# EAGLE design HIC_Board (EAGLE 7.5.0)
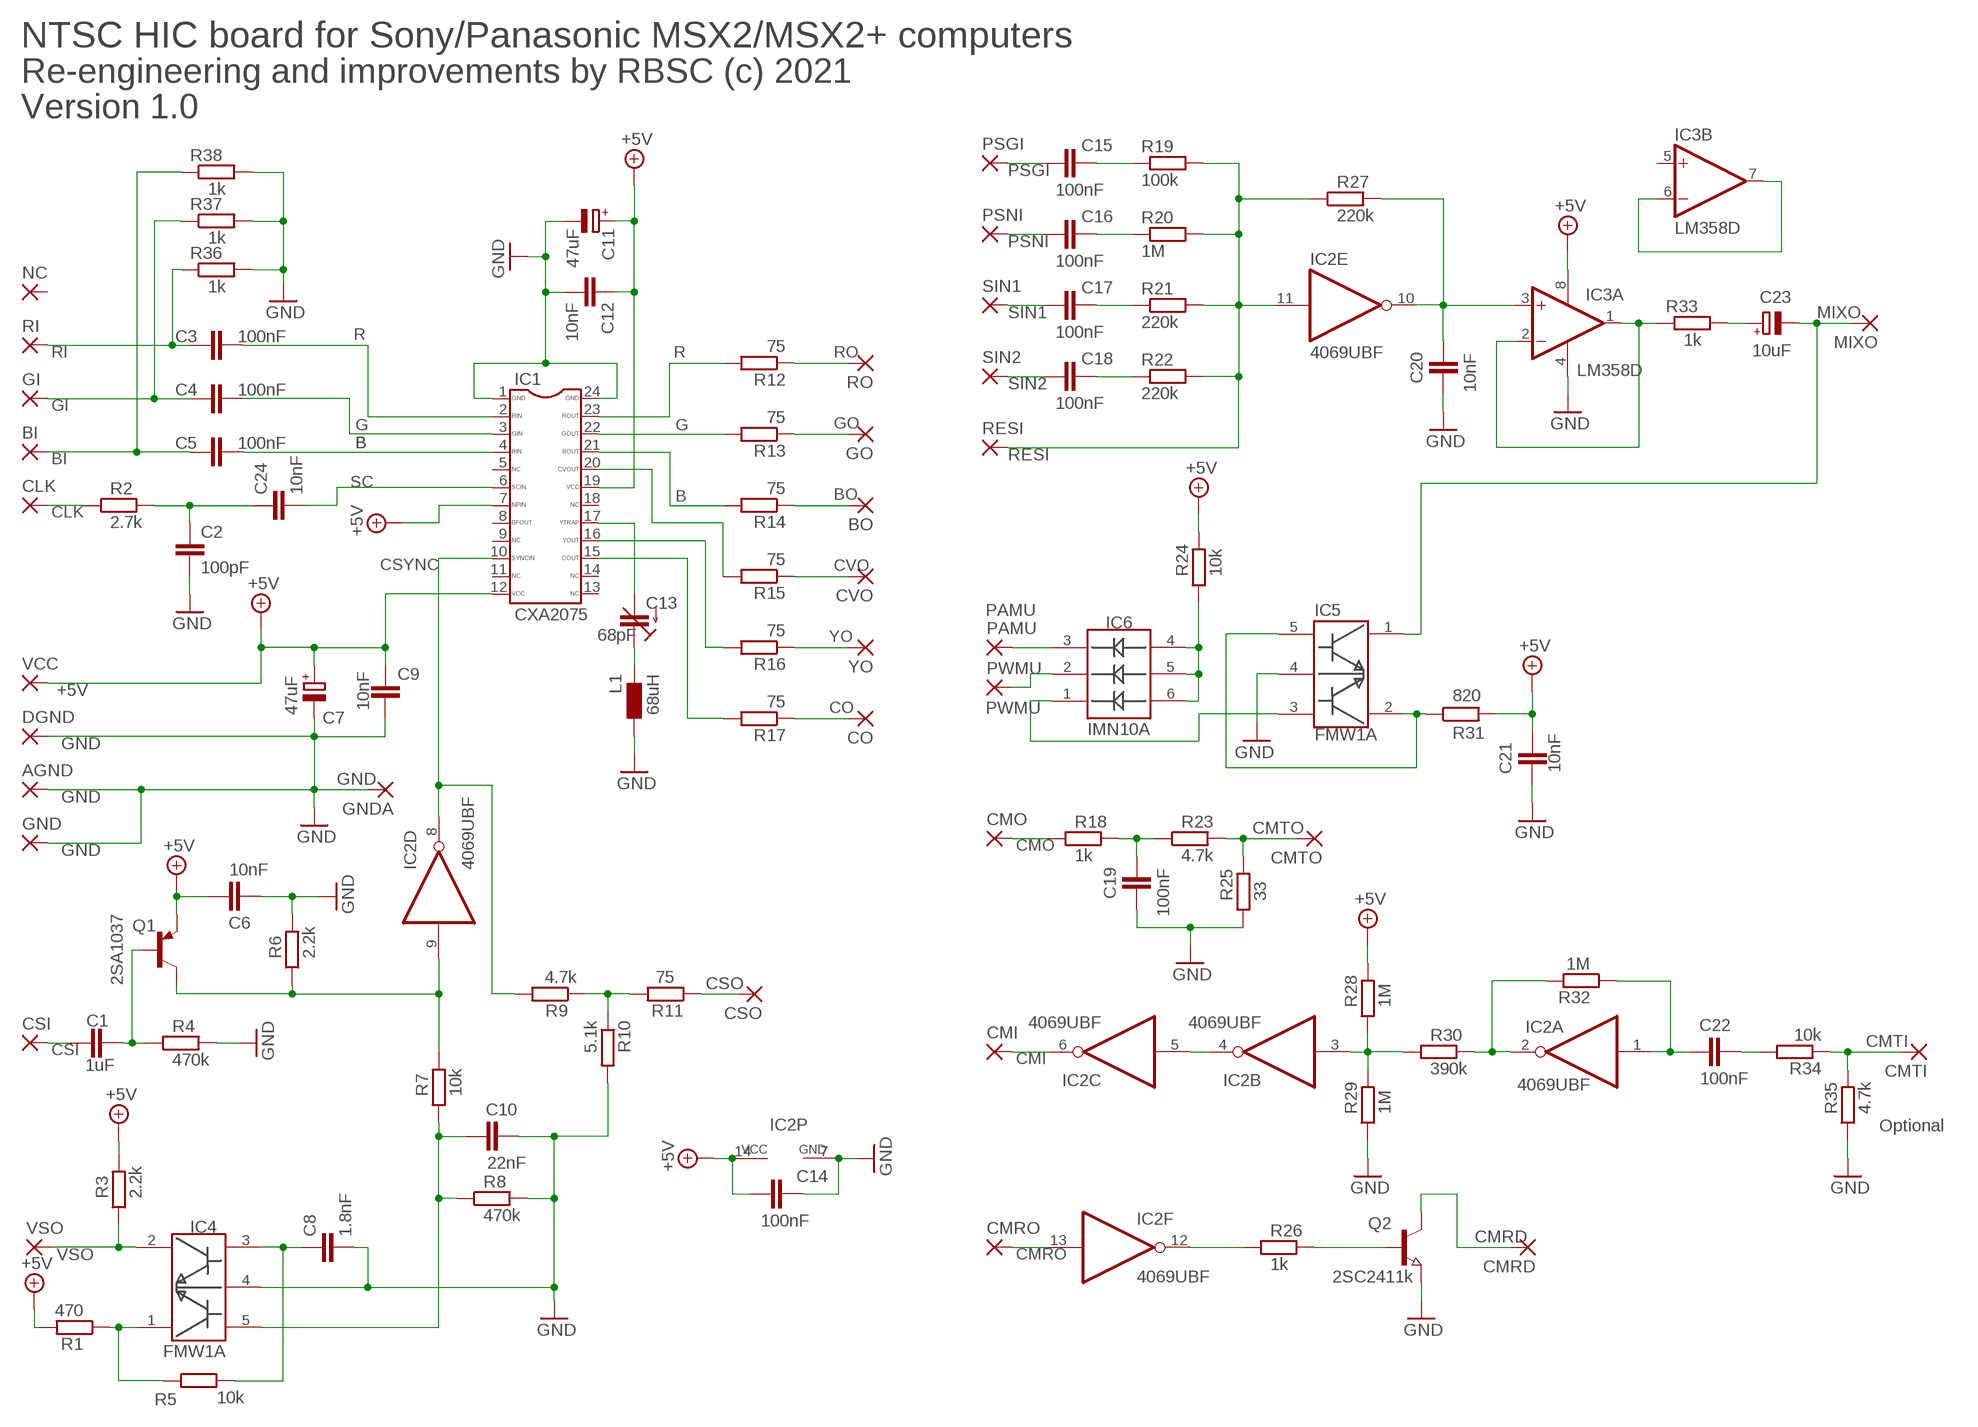
[diagram p0: schematic, sheet 1]

## Parts
AGND  HICPADSMD  [SMD1,27-2,54]
BI  HICPADSMD  [SMD1,27-2,54]
BO  HICPADSMD  [SMD1,27-2,54]
C1  1uF  C-EUC1210  [C1210]
C2  100pF  C-EUC0805  [C0805]
C3  100nF  C-EUC0805  [C0805]
C4  100nF  C-EUC0805  [C0805]
C5  100nF  C-EUC0805  [C0805]
C6  10nF  C-EUC0805  [C0805]
C7  47uF  CPOL-EUSMCB  [SMC_B]
C8  1.8nF  C-EUC0805  [C0805]
C9  10nF  C-EUC0805  [C0805]
C10  22nF  C-EUC0805  [C0805]
C11  47uF  CPOL-EUSMCB  [SMC_B]
C12  10nF  C-EUC0805  [C0805]
C13  68pF  C-TRIMMTZ03  [CTRIMTZ03]
C14  100nF  C-EUC0805  [C0805]
C15  100nF  C-EUC0805  [C0805]
C16  100nF  C-EUC0805  [C0805]
C17  100nF  C-EUC0805  [C0805]
C18  100nF  C-EUC0805  [C0805]
C19  100nF  C-EUC0805  [C0805]
C20  10nF  C-EUC0805  [C0805]
C21  10nF  C-EUC0805  [C0805]
C22  100nF  C-EUC0805  [C0805]
C23  10uF  CPOL-EUSMCB  [SMC_B]
C24  10nF  C-EUC0805  [C0805]
CLK  HICPADSMD  [SMD1,27-2,54]
CMI  HICPADSMD  [SMD1,27-2,54]
CMO  HICPADSMD  [SMD1,27-2,54]
CMRD  HICPADSMD  [SMD1,27-2,54]
CMRO  HICPADSMD  [SMD1,27-2,54]
CMTI  HICPADSMD  [SMD1,27-2,54]
CMTO  HICPADSMD  [SMD1,27-2,54]
CO  HICPADSMD  [SMD1,27-2,54]
CSI  HICPADSMD  [SMD1,27-2,54]
CSO  HICPADSMD  [SMD1,27-2,54]
CVO  HICPADSMD  [SMD1,27-2,54]
DGND  HICPADSMD  [SMD1,27-2,54]
GI  HICPADSMD  [SMD1,27-2,54]
GND  HICPADSMD  [SMD1,27-2,54]
GNDA  HICPADSMD  [SMD1,27-2,54]
GO  HICPADSMD  [SMD1,27-2,54]
IC1  CXA2075  [SOP24]
IC2  4069UBF  74HCT04D  [SO14]
IC3  LM358D  [SO08]
IC4  FMW1A  [SMT5]
IC5  FMW1A  [SMT5]
IC6  IMN10A  [SMT6]
L1  68uH  LL3225M  [L3225M]
MIXO  HICPADSMD  [SMD1,27-2,54]
NC  HICPADSMD  [SMD1,27-2,54]
PAMU  HICPADSMD  [SMD1,27-2,54]
PSGI  HICPADSMD  [SMD1,27-2,54]
PSNI  HICPADSMD  [SMD1,27-2,54]
PWMU  HICPADSMD  [SMD1,27-2,54]
Q1  2SA1037  BCX71SMD  [SOT23]
Q2  2SC2411k  NPN-TRANSISTOR_SOT23  [SOT23]
R1  470  R-EU_R0805  [R0805]
R2  2.7k  R-EU_R0805  [R0805]
R3  2.2k  R-EU_R0805  [R0805]
R4  470k  R-EU_R0805  [R0805]
R5  10k  R-EU_R0805  [R0805]
R6  2.2k  R-EU_R0805  [R0805]
R7  10k  R-EU_R0805  [R0805]
R8  470k  R-EU_R0805  [R0805]
R9  4.7k  R-EU_R0805  [R0805]
R10  5.1k  R-EU_R0805  [R0805]
R11  75  R-EU_R0805  [R0805]
R12  75  R-EU_R0805  [R0805]
R13  75  R-EU_R0805  [R0805]
R14  75  R-EU_R0805  [R0805]
R15  75  R-EU_R0805  [R0805]
R16  75  R-EU_R0805  [R0805]
R17  75  R-EU_R0805  [R0805]
R18  1k  R-EU_R0805  [R0805]
R19  100k  R-EU_R0805  [R0805]
R20  1M  R-EU_R0805  [R0805]
R21  220k  R-EU_R0805  [R0805]
R22  220k  R-EU_R0805  [R0805]
R23  4.7k  R-EU_R0805  [R0805]
R24  10k  R-EU_R0805  [R0805]
R25  33  R-EU_R0805  [R0805]
R26  1k  R-EU_R0805  [R0805]
R27  220k  R-EU_R0805  [R0805]
R28  1M  R-EU_R0805  [R0805]
R29  1M  R-EU_R0805  [R0805]
R30  390k  R-EU_R0805  [R0805]
R31  820  R-EU_R0805  [R0805]
R32  1M  R-EU_R0805  [R0805]
R33  1k  R-EU_R0805  [R0805]
R34  10k  R-EU_R0805  [R0805]
R35  4.7k  R-EU_R0805  [R0805]
R36  1k  R-EU_R0805  [R0805]
R37  1k  R-EU_R0805  [R0805]
R38  1k  R-EU_R0805  [R0805]
RESI  HICPADSMD  [SMD1,27-2,54]
RI  HICPADSMD  [SMD1,27-2,54]
RO  HICPADSMD  [SMD1,27-2,54]
SIN1  HICPADSMD  [SMD1,27-2,54]
SIN2  HICPADSMD  [SMD1,27-2,54]
VCC  HICPADSMD  [SMD1,27-2,54]
VSO  HICPADSMD  [SMD1,27-2,54]
YO  HICPADSMD  [SMD1,27-2,54]

## Nets
+5V: C6.1 C7.+ C9.2 C11.+ C12.1 C14.2 C21.2 IC1.7 IC1.12 IC1.19 IC2.14(P:VCC) IC3.8(P:V+) Q1.2(E) R1.2 R3.2 R24.2 R28.2 R31.2 VCC.1(P)
CMRD: CMRD.1(P) Q2.3(C)
CMTI: CMTI.1(P) R34.1 R35.2
CMTO: CMTO.1(P) R23.2 R25.2
CSO: CSO.1(P) R11.1
GND: AGND.1(P) C2.1 C6.2 C7.- C8.1 C9.1 C10.2 C11.- C12.2 C14.1 C19.2 C20.2 C21.1 DGND.1(P) GND.1(P) GNDA.1(P) IC1.1 IC1.24 IC2.7(P:GND) IC3.4(P:V-) IC4.4 IC5.4 L1.1 Q2.2(E) R4.2 R6.2 R8.2 R10.2 R25.1 R29.1 R35.1 R36.2 R37.2 R38.2
MIXO: C23.- IC5.1 MIXO.1(P)
N$1: IC1.23 R12.2
N$2: IC1.22 R13.2
N$3: IC1.21 R14.2
N$4: R12.1 RO.1(P)
N$5: GO.1(P) R13.1
N$6: C3.1 R36.1 RI.1(P)
N$7: C4.1 GI.1(P) R37.1
N$8: BO.1(P) R14.1
N$9: R16.1 YO.1(P)
N$10: CVO.1(P) R15.1
N$11: C2.2 C24.2 R2.2
N$13: C1.2 CSI.1(P)
N$14: CLK.1(P) R2.1
N$15: C13.1(E) L1.2
N$16: IC1.16 R16.2
N$17: CMO.1(P) R18.1
N$19: CMI.1(P) IC2.6(C:O)
N$21: C19.1 R18.2 R23.1
N$22: IC2.4(B:O) IC2.5(C:I)
N$24: C13.2(A) IC1.17
N$25: IC2.3(B:I) R28.1 R29.2 R30.1
N$26: CMRO.1(P) IC2.13(F:I)
N$27: IC2.2(A:O) R30.2 R32.2
N$28: C22.1 IC2.1(A:I) R32.1
N$29: C22.2 R34.2
N$31: IC2.12(F:O) R26.1
N$32: Q2.1(B) R26.2
N$38: C17.2 R21.1
N$39: C15.2 R19.1
N$40: C16.2 R20.1
N$41: C18.2 R22.1
N$43: C20.1 IC2.10(E:O) IC3.3(A:+IN) R27.2
N$44: C23.+ R33.2
N$46: IC3.6(B:-IN) IC3.7(B:OUT)
N$47: IC5.2 IC5.5 R31.1
N$48: IC5.3 IC6.1
N$49: IC6.4 IC6.5 IC6.6 R24.1
N$51: C1.1 Q1.1(B) R4.1
N$52: IC3.1(A:OUT) IC3.2(A:-IN) R33.1
N$53: IC2.9(D:I) Q1.3(C) R6.1 R7.2
N$54: C8.2 IC4.3 R5.2
N$55: BI.1(P) C5.1 R38.1
N$56: C4.2 IC1.3
N$57: C3.2 IC1.2
N$58: C5.2 IC1.4
N$59: IC1.10 IC2.8(D:O) R9.2
N$60: IC4.1 R1.1 R5.1
N$61: R9.1 R10.1 R11.2
N$62: C10.1 IC4.5 R7.1 R8.1
N$63: C24.1 IC1.6
N$64: IC1.20 R15.2
N$65: CO.1(P) R17.1
N$68: IC1.15 R17.2
PAMU: IC6.3 PAMU.1(P)
PSGI: C15.1 PSGI.1(P)
PSNI: C16.1 PSNI.1(P)
PWMU: IC6.2 PWMU.1(P)
RESI: IC2.11(E:I) R19.2 R20.2 R21.2 R22.2 R27.1 RESI.1(P)
SIN1: C17.1 SIN1.1(P)
SIN2: C18.1 SIN2.1(P)
VSO: IC4.2 R3.1 VSO.1(P)
Unconnected: IC1.5 IC1.8 IC1.9 IC1.11 IC1.13 IC1.14 IC1.18 IC3.5(B:+IN) NC.1(P)

## Notes on the sheet
- NTSC HIC board for Sony/Panasonic MSX2/MSX2+ computers
- Re-engineering and improvements by RBSC (c) 2021
- Version 1.0
- R
- RI | R | RO
- GI
- G | G | GO
- B | B
- BI
- SC
- B | BO
- CLK
- CSYNC
- CVO
- YO
- CO
- CMO
- CSI
- CMI
- Optional
- CMRO

## Library data of the parts
AGND BI BO CLK CMI CMO CMRD CMRO CMTI CMTO CO CSI CSO CVO DGND GI GND GNDA GO MIXO NC PAMU PSGI PSNI PWMU RESI RI RO SIN1 SIN2 VCC VSO YO = combopad:HICPADSMD: SMD PAD
C1-C6 C8-C10 C12 C14-C22 C24 = rcl:C-EU: CAPACITOR, European symbol; OC_FARNELL: unknown
C7 C11 C23 = rcl:CPOL-EU: POLARIZED CAPACITOR, European symbol; OC_FARNELL: unknown
C13 = rcl:C-TRIMM: Trimm capacitor
IC1 = CXA2075M:CXA2075; OC_FARNELL: unknown
IC2 = 74xx-eu:74*04: Hex INVERTER
IC3 = linear:LM358: OP AMP also LM158; LM258; LM2904 Source: http://cache.national.com/ds/LM/LM158.pdf
IC4 IC5 = fmw1:FMW1: FMW1
IC6 = imn10:IMN10: IMN10
L1 = eagle-ltspice:L: INDUCTOR, European symbol; SPICEMODEL: NONE; SPICEPREFIX: L
Q1 = transistor-pnp:BCX71SMD: PNP Transistor
Q2 = semicon-smd-ipc:NPN-TRANSISTOR_: NPN TRANSISTOR
R1-R38 = rcl:R-EU_: RESISTOR, European symbol; OC_FARNELL: unknown

## Board
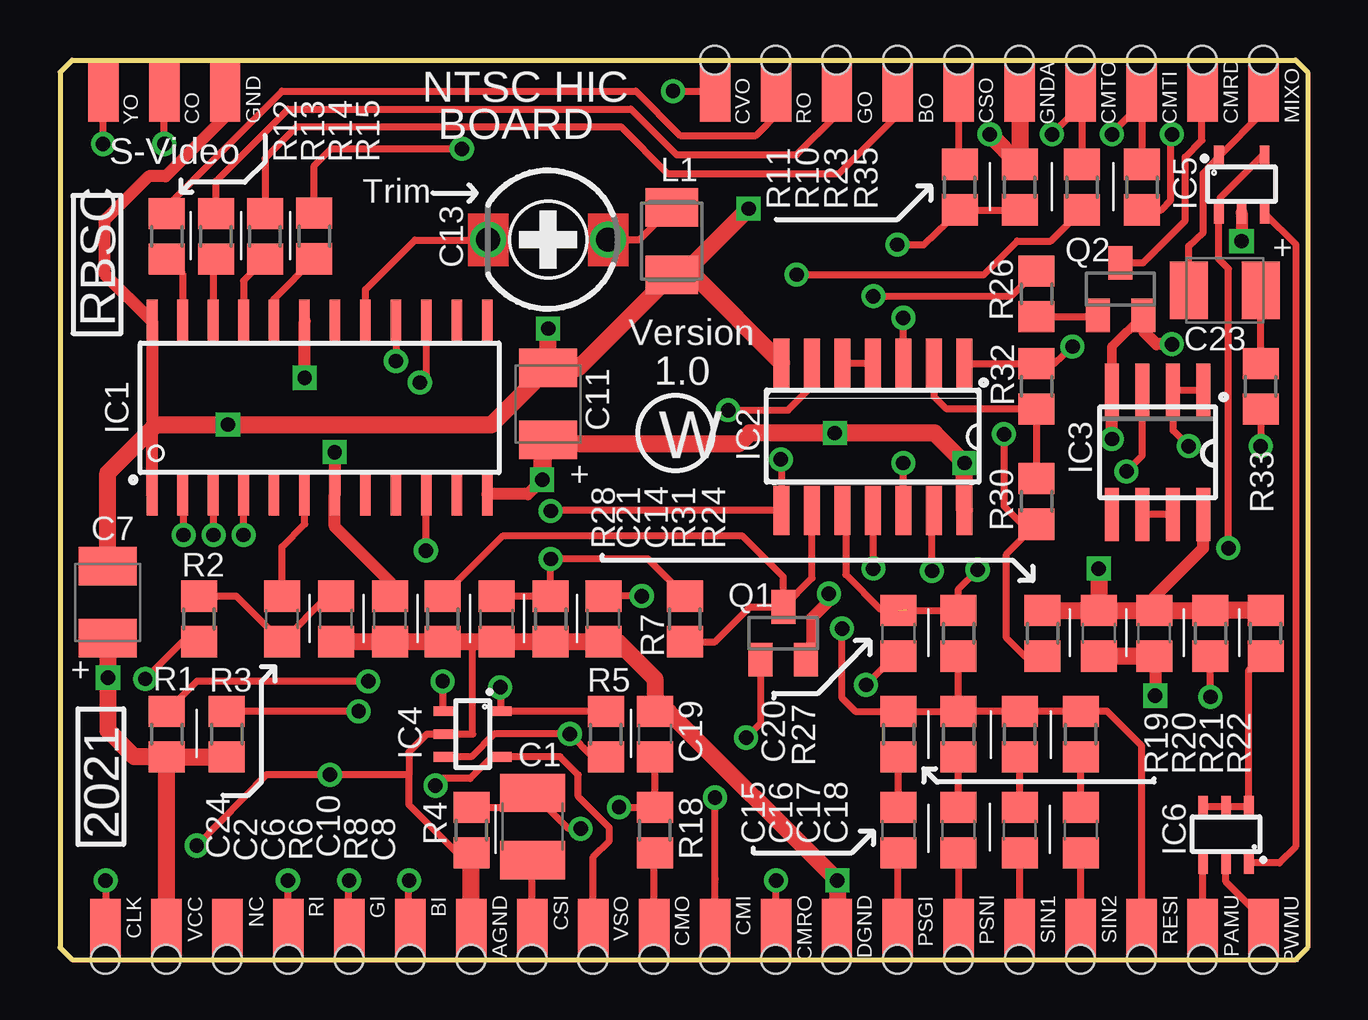
[diagram p1: board, top side]
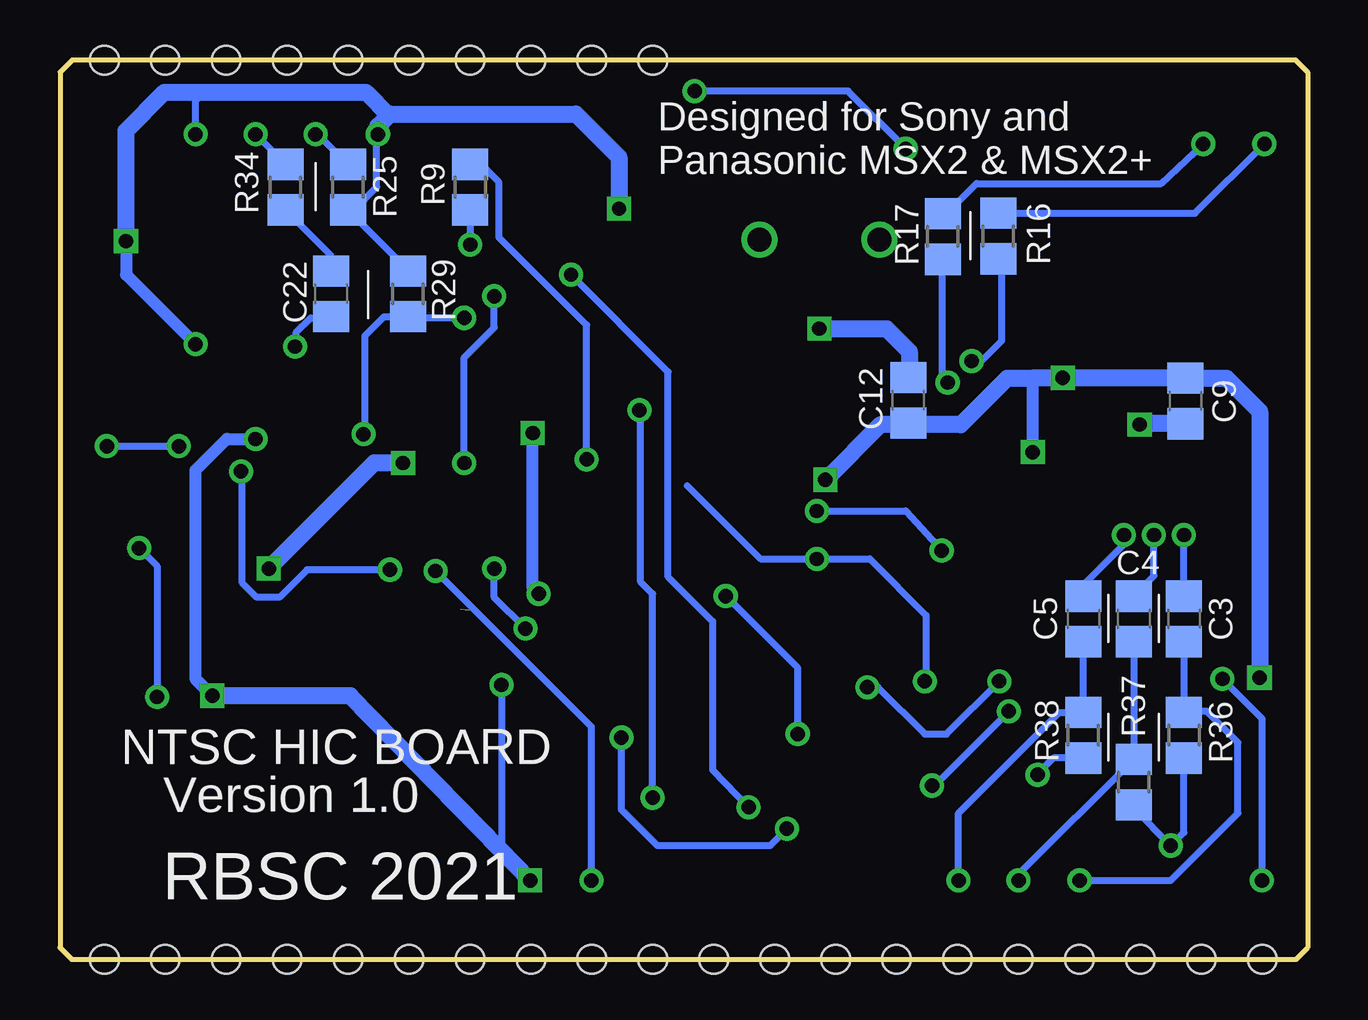
[diagram p2: board, bottom side, seen from below]

Size 52 x 37.5 mm. Coordinates in mm from the lower left corner, seen from the top.
Outline: 0,37 0,0.5 0.5,0 51.5,0 52,0.5 52,37 51.5,37.5 0.5,37.5 0,37
Copper layers (1*16): Top 0.035mm / dielectric 1.5mm / Bottom 0.035mm
Design rules "default *": minimum track width 10mil, minimum drill 24mil, track to track 8mil, track to pad 8mil, pad to pad 8mil, via to via 8mil, smd to smd 8mil, copper to edge 4mil, drill to drill 8mil, minimum pad ring 10mil, minimum via ring 8mil, stop-mask expansion 4mil, vias tented up to drill 24mil, thermal gap 10mil
Holes 1.2 mm at 27.29,37.49 29.83,37.49 32.37,37.49 34.91,37.49 37.45,37.49 39.99,37.49 42.53,37.49 45.07,37.49 47.61,37.49 50.15,37.49 1.89,0.01 4.43,0.01 6.97,0.01 9.51,0.01 12.05,0.01 14.59,0.01 17.13,0.01 19.67,0.01 22.21,0.01 24.75,0.01 27.29,0.01 29.83,0.01 32.37,0.01 34.91,0.01 37.45,0.01 39.99,0.01 42.53,0.01 45.07,0.01 47.61,0.01 50.15,0.01

### Footprints (pad centres in the part's own frame; a part is rotated, then mirrored left to right if it is on the bottom)
SMD1,27-2,54 = smd 1.27 x 2.54: 1 0,0
C1210 = smd 1.6 x 2.7: 1 -1.4,0; 2 1.4,0
C0805 = smd 1.3 x 1.5: 1 -0.95,0; 2 0.95,0
SMC_B = smd 1.6 x 2.4: + -1.5,0; - 1.5,0
CTRIMTZ03 = drill 1: 1 0,2.5; 2 0,-2.5
SOP24 = smd 0.45 x 1.8: 1 -6.97,-3.6; 2 -5.7,-3.6; 3 -4.43,-3.6; 4 -3.16,-3.6; 5 -1.89,-3.6; 6 -0.62,-3.6; 7 0.65,-3.6; 8 1.92,-3.6; 9 3.19,-3.6; 10 4.46,-3.6; 11 5.73,-3.6; 12 7,-3.6; 13 7,3.6; 14 5.73,3.6; 15 4.46,3.6; 16 3.19,3.6; 17 1.92,3.6; 18 0.65,3.6; 19 -0.62,3.6; 20 -1.89,3.6; 21 -3.16,3.6; 22 -4.43,3.6; 23 -5.7,3.6; 24 -6.97,3.6
SO14 = smd 0.66 x 2.032: 1 -3.81,-3.073; 2 -2.54,-3.073; 3 -1.27,-3.073; 4 0,-3.073; 5 1.27,-3.073; 6 2.54,-3.073; 7 3.81,-3.073; 8 3.81,3.073; 9 2.54,3.073; 10 1.27,3.073; 11 0,3.073; 12 -1.27,3.073; 13 -2.54,3.073; 14 -3.81,3.073
SO08 = smd 0.6 x 2.2: 1 -1.905,-2.6; 2 -0.635,-2.6; 3 0.635,-2.6; 4 1.905,-2.6; 5 1.905,2.6; 6 0.635,2.6; 7 -0.635,2.6; 8 -1.905,2.6
SMT5 = smd 0.9 x 0.4: 1 1.175,0.95; 2 1.175,-0.95; 3 -1.175,-0.95; 4 -1.175,0; 5 -1.175,0.95
SMT6 = smd 0.9 x 0.4: 1 1.175,0.95; 2 1.175,0; 3 1.175,-0.95; 4 -1.175,-0.95; 5 -1.175,0; 6 -1.175,0.95
L3225M = smd 1.6 x 2.2: 1 -1.4,0; 2 1.4,0
SOT23 = smd 1 x 1.4: 1 -0.95,-1.1; 2 0.95,-1.1; 3 0,1.1
R0805 = smd 1.3 x 1.5: 1 -0.95,0; 2 0.95,0

### Placement (x,y rotation side)
AGND  17.14,1.27 0 top
BI  14.61,1.27 0 top
BO  34.92,36.2 180 top
C1  19.7,5.55 270 top
C2  11.5,14.2 90 top
C3  5.15,14.2 90 bottom
C4  7.24,14.2 90 bottom
C5  9.34,14.2 90 bottom
C6  13.75,14.2 270 top
C7  1.99,14.89 90 top
C8  22.65,14.2 90 top
C9  5.09,23.29 90 bottom
C10  18.2,14.2 270 top
C11  20.34,23.16 90 top
C12  16.64,23.31 90 bottom
C13  20.34,30.01 270 top
C14  45.61,13.6 90 top
C15  34.95,5.4 90 top
C16  37.45,5.4 90 top
C17  40,5.4 90 top
C18  42.55,5.4 90 top
C19  24.8,9.4 90 top
C20  34.95,13.6 270 top
C21  43.3,13.6 90 top
C22  40.7,27.75 90 bottom
C23  48.55,27.9 180 top
C24  9.25,14.2 270 top
CLK  1.91,1.27 0 top
CMI  27.3,1.27 0 top
CMO  24.77,1.27 0 top
CMRD  47.62,36.2 180 top
CMRO  29.84,1.27 0 top
CMTI  45.09,36.2 180 top
CMTO  42.55,36.2 180 top
CO  4.34,36.2 180 top
CSI  19.68,1.27 0 top
CSO  37.47,36.2 180 top
CVO  27.3,36.2 180 top
DGND  32.38,1.27 0 top
GI  12.06,1.27 0 top
GND  6.88,36.2 0 top
GNDA  40.01,36.2 180 top
GO  32.38,36.2 180 top
IC1  10.81,23 0 top
IC2  33.89,21.8 180 top
IC3  45.75,21.15 180 top
IC4  17.2,9.4 0 top
IC5  49.25,32.3 90 top
IC6  48.6,5.2 270 top
L1  25.5,29.95 90 top
MIXO  50.16,36.2 180 top
NC  6.99,1.27 0 top
PAMU  47.62,1.27 0 top
PSGI  34.92,1.27 0 top
PSNI  37.47,1.27 0 top
PWMU  50.16,1.27 0 top
Q1  30.15,13.6 0 top
Q2  44.2,27.95 0 top
R1  4.45,9.4 270 top
R2  5.8,14.2 90 top
R3  6.95,9.4 270 top
R4  17.15,5.4 270 top
R5  22.75,9.4 270 top
R6  15.95,14.2 270 top
R7  26.05,14.2 270 top
R8  20.45,14.2 270 top
R9  34.9,32.2 90 bottom
R10  40,32.2 90 top
R11  37.5,32.2 270 top
R12  4.45,30.15 270 top
R13  6.5,30.15 270 top
R14  8.55,30.15 270 top
R15  10.6,30.16 270 top
R16  12.89,30.16 270 bottom
R17  15.21,30.14 270 bottom
R18  24.8,5.4 90 top
R19  34.95,9.4 90 top
R20  37.45,9.4 90 top
R21  40,9.4 90 top
R22  42.55,9.4 90 top
R23  42.6,32.2 90 top
R24  50.25,13.6 90 top
R25  40,32.2 90 bottom
R26  40.7,27.75 270 top
R27  37.45,13.6 90 top
R28  40.95,13.6 90 top
R29  37.5,27.75 270 bottom
R30  40.7,19.1 90 top
R31  47.95,13.6 90 top
R32  40.7,23.9 270 top
R33  50.05,23.9 90 top
R34  42.6,32.2 270 bottom
R35  45.1,32.2 90 top
R36  5.15,9.35 270 bottom
R37  7.25,7.4 270 bottom
R38  9.35,9.35 270 bottom
RESI  45.09,1.27 0 top
RI  9.53,1.27 0 top
RO  29.84,36.2 180 top
SIN1  40.01,1.27 0 top
SIN2  42.55,1.27 0 top
VCC  4.45,1.27 0 top
VSO  22.23,1.27 0 top
YO  1.8,36.2 180 top

### Tracks (layer width: path | path; a pad name or v marks a point on that pad's centre or on a via)
+5V  (via drill 0.6)
  Top 0.3: C14.2 45.61,15.11 | IC3.8 | C11.+ 20.34,20.25 v20.1,20 | IC1.12 | C6.1 13.75,15.75 | IC1.7
  Top 0.4: 10.2,26.59 IC1.19 | v11.46,21.14 v11.45,21.15
  Top 0.5: 45.61,15.11 47.65,17.15 IC3.8 | v20.1,20 19.5,19.4 IC1.12 | v10.2,24.25 10.2,26.59 | IC1.7 v11.46,21.14 | 13.75,15.75 11.45,18.05 IC1.7 | v32.05,15.25 32.05,14.95 31.35,14.25 31.35,12.75 Q1.2
  Top 0.7: v20.1,20 20.1,21.41 C11.+ 20.5,21.5 28.3,21.5 28.75,21.95 v32.3,21.95 36.45,21.95 v37.7,20.7 IC2.14 | VCC.1 R1.2 | R1.2 R3.2 | R1.2 3.1,8.45 2,9.55 v2,11.75 C7.+ | v43.3,16.3 C21.2 | C21.2 C14.2 R31.2 R24.2 | R28.2 C21.2
  Bottom 0.4: 10.21,24.23 v10.2,24.25
  Bottom 0.5: v11.45,21.15 11.45,24.18 | v32.05,15.25 32.3,15.5 v32.3,21.95
  Bottom 0.7: 11.5,24.23 10.21,24.23 C9.2 3.38,24.23 2,22.85 v2,11.75 | 16.59,22.3 14.45,22.3 12.52,24.23 11.5,24.23 | 16.59,22.3 C12.1 | 16.59,22.3 17.8,22.3 v20.1,20 | v37.7,20.7 38.9,20.7 v43.3,16.3 | 11.5,24.23 11.45,24.18
CMRD
  Top 0.3: Q2.3 45.15,29.05 46.9,30.8 46.9,33.45 47.6,34.15 47.6,36.17 CMRD.1
CMTI  (via drill 0.6)
  Top 0.3: CMTI.1 45.1,36.18 45.1,35.7 | 45.1,35.7 R35.2 | v43.85,34.4 43.85,34.45 45.1,35.7
  Bottom 0.3: R34.1 v43.85,34.4
CMTO  (via drill 0.6)
  Top 0.3: CMTO.1 42.6,36.14 42.6,35.65 | 42.6,35.65 R23.2 | v41.35,34.4 42.6,35.65
  Bottom 0.3: v41.35,34.4 41.2,34.35 R25.2
CSO
  Top 0.3: 37.5,36.16 CSO.1 37.47,33.19 R11.1
GND  (via drill 0.6)
  Top 0.3: R4.2 16.55,4.45 14.55,6.45 14.55,7.7 | 32.4,1.28 DGND.1 | 24.4,10 C19.2 | C11.- 20.79,24.66 | v20.34,26.3 v20.35,26.3 | 45.2,26.15 45.2,26.8 Q2.2 | 17.25,13.25 17.2,13.2 17.2,9.4 IC4.4 15.3,9.4 14.55,8.65 14.55,7.7 | C14.1 45.65,12.61 | v43.85,21.7 v43.84,21.7 | R10.2 39.95,33.16 | R35.1 45.9,31.25 46.3,31.65 46.3,34.3 v46.35,34.4 | 14.55,7.7 v11.25,7.7 8.6,7.7 v5.7,4.75 | C20.2 34.8,12.65 v33.6,11.45
  Top 0.4: IC3.4 43.84,25.55 Q2.2 | 3.84,22.26 3.9,22.2 | 3.84,22.11 3.83,22.12
  Top 0.5: IC5.4 v49.25,29.95 | v46.35,25.65 45.7,25.65 45.2,26.15 | 3.84,22.26 IC1.24 1.85,28.59 1.85,30.8 3.7,32.65 4.4,32.65 6.88,35.13 GND.1 | IC1.1 3.84,22.11 | 45.65,12.61 v45.65,11 | v43.84,21.7 IC3.4
  Top 0.7: AGND.1 R4.2 | 32.4,1.28 v32.4,3.3 25.35,10.35 C19.2 24.8,11.7 23.3,13.2 22.7,13.2 C8.1 R8.2 C10.2 17.25,13.25 R6.2 C6.2 C2.1 | v20.34,26.3 C11.- 17.98,22.3 v7,22.3 4,22.3 3.9,22.2 3.83,22.12 1.99,20.29 C7.- | 20.79,24.66 21.61,24.66 L1.1 | L1.1 26.4,28.55 IC2.7 | C21.1 C14.1 | L1.1 25.95,28.55 v28.7,31.3 | GNDA.1 R10.2 | 39.95,33.16 v38.75,34.4
  Bottom 0.3: 16.6,24.3 C12.2 | R29.1 37.5,29.15 37.9,29.15 R25.1 39.75,31.25 38.8,32.2 38.8,34.35 v38.75,34.4 | v46.35,34.4 46.35,35.8 46,36.15 | 6.96,22.34 v7,22.3 | R38.2 10.6,8.4 11.25,7.75 v11.25,7.7 | R37.2 7.25,6.3 v5.7,4.75 5.15,5.3 R36.2 | v33.6,11.45 33.6,4.64 33.65,4.59
  Bottom 0.5: v49.25,29.95 49.25,28.55 v46.35,25.65 | v45.65,11 46.35,11.7 46.35,20.4 45.05,21.7 v43.85,21.7
  Bottom 0.7: v20.35,26.3 17.55,26.3 16.6,25.35 16.6,24.3 | v32.4,3.3 33.65,4.59 39.9,11 v45.65,11 | 38.3,35.2 38.25,35.25 30.5,35.25 28.7,33.45 v28.7,31.3 28.75,31.3 | v49.25,29.95 49.25,34.55 47.65,36.15 46,36.15 39.25,36.15 38.3,35.2 | v38.75,34.4 38.75,34.75 38.3,35.2 | C9.1 6.96,22.34
MIXO
  Top 0.3: MIXO.1 50.16,35.34 IC5.1 47.65,32.77 47.65,30.3 47.05,29.75 C23.-
N$1
  Top 0.3: R12.2 5.11,28.59 IC1.23
N$2
  Top 0.3: R13.2 6.38,29.08 IC1.22
N$3
  Top 0.3: R14.2 7.65,28.3 IC1.21
N$4
  Top 0.3: R12.1 4.5,31.45 9.25,36.2 24,36.2 25.85,34.35 29,34.35 30.05,35.4 30.05,35.99 RO.1
N$5
  Top 0.3: R13.1 6.5,32.45 9.5,35.45 23.8,35.45 25.7,33.55 30.7,33.55 32.4,35.25 32.4,36.18 GO.1
N$6  (via drill 0.6)
  Top 0.3: RI.1 9.5,1.29 v9.5,3.3
  Bottom 0.3: C3.1 R36.1 5.1,10.35 4.2,10.35 2.9,9.05 2.9,6.1 5.7,3.3 v9.5,3.3
N$7  (via drill 0.6)
  Top 0.3: GI.1 12.04,1.29 v12.04,3.29 v12.05,3.3
  Bottom 0.3: C4.1 R37.1 12.05,3.55 v12.05,3.3
N$8
  Top 0.3: 34.92,36.12 BO.1 34.95,36.17 34.95,35.25 32.45,32.75 25.35,32.75 23.4,34.7 9.85,34.7 8.55,33.4 R14.1
N$9  (via drill 0.6)
  Top 0.3: v1.8,34 YO.1
  Bottom 0.3: R16.1 4.69,31.11 v1.8,34
N$10  (via drill 0.6)
  Top 0.3: R15.1 10.6,33.09 11.3,33.8 v16.75,33.8 | v25.55,36.2 CVO.1
  Bottom 0.3: v16.75,33.8 19.15,36.2 v25.55,36.2
N$11
  Top 0.3: R2.2 7.35,15.15 C24.2 11.15,15.15 C2.2
N$13
  Top 0.3: CSI.1 19.68,4.13 C1.2
N$14  (via drill 0.6)
  Top 0.3: 2,1.36 CLK.1 1.91,3.65 v1.9,3.3 | R2.1 5.1,13.25 v3.55,11.7
  Bottom 0.3: v3.55,11.7 1.9,10.05 v1.9,3.3
N$15
  Top 0.3: C13.1 24.16,30.01 L1.2
N$16  (via drill 0.6)
  Top 0.3: IC1.16 v14,24.95
  Bottom 0.3: v14,24.95 13.6,24.95 12.75,25.8 12.75,29.07 R16.2
N$17
  Top 0.3: CMO.1 24.77,4.42 R18.1
N$19  (via drill 0.6)
  Top 0.3: v27.85,22.9 30.35,22.9 31.35,23.9 IC2.6 | CMI.1 27.3,3.35 v27.3,6.75
  Bottom 0.3: v27.85,22.9 27.8,22.85 27.8,15.75 27.3,15.25 v27.3,6.75
N$21  (via drill 0.6)
  Top 0.3: v30.7,28.55 38.5,28.55 39.9,29.95 41.3,29.95 R23.1 | C19.1 R18.2 v23.3,6.35
  Bottom 0.3: v30.7,28.55 26.65,24.5 26.65,15.95 24.8,14.1 24.8,7.9 v23.3,6.35
N$22
  Top 0.3: IC2.5 IC2.4
N$24
  Top 0.3: IC1.17 12.73,27.93 14.8,30 C13.2
N$25  (via drill 0.6)
  Top 0.3: IC2.3 v35.16,26.76 v35.15,26.75 | R28.1 40.2,12.65 39.45,13.4 39.45,16.9 R30.1 40.1,18.15 39.35,18.9 v39.35,21.9
  Bottom 0.3: v39.35,21.9 39.3,21.95 39.3,26 38.5,26.8 R29.2 37.45,26.75 v35.15,26.75
N$26  (via drill 0.6)
  Top 0.3: CMRO.1 29.84,3.4 v29.85,3.3 | 36.45,18.7 IC2.13 36.35,18.64 v36.35,16.2
  Bottom 0.3: v29.85,3.3 29.85,9.7 v36.35,16.2
N$27
  Top 0.3: IC2.2 36.45,24.85 36.45,23.45 36.95,22.95 R32.2 R30.2
N$28  (via drill 0.6)
  Top 0.3: IC2.1 37.72,24.85 R32.1 41.45,24.85 v42.2,25.55
  Bottom 0.3: v42.2,25.55 42.15,26.15 41.55,26.75 40.75,26.75 C22.1
N$29
  Bottom 0.3: C22.2 40.7,29.35 R34.2
N$31  (via drill 0.6)
  Top 0.3: IC2.12 35.15,18.73 v35.15,20.7 | v33.9,27.65 39.65,27.65 R26.1
  Bottom 0.3: v35.15,20.7 35.15,25.1 33.9,26.35 v33.9,27.65
N$32
  Top 0.3: R26.2 43.2,26.8 Q2.1
N$38
  Top 0.3: C17.2 R21.1
N$39
  Top 0.3: C15.2 R19.1
N$40
  Top 0.3: C16.2 R20.1
N$41
  Top 0.3: C18.2 R22.1
N$43  (via drill 0.6)  (1 unrouted)
  Top 0.3: IC2.10 32.75,18.59 32.75,16.05 34.2,14.6 35.3,14.6 | v38.25,16.25 37.45,15.45 R27.2 C20.1 | IC3.3 45.1,23.73 45.1,21 v44.45,20.35
  Bottom 0.3: v38.25,16.25 41.7,16.25 42.85,15.1 43.8,15.1 44.4,15.7 44.4,20.3 v44.45,20.35
N$44
  Top 0.3: R33.2 C23.+
N$46
  Top 0.3: IC3.7 IC3.6
N$47  (via drill 0.6)
  Top 0.3: v48.7,17.15 48.7,28.8 48.3,29.2 IC5.5 48.35,31.18 48.35,31.75 50.08,33.48 IC5.2 | v47.95,10.95 R31.1
  Bottom 0.3: v48.7,17.15 47.95,16.4 v47.95,10.95
N$48
  Top 0.3: IC5.3 51.5,29.82 51.5,4.7 50.83,4.03 IC6.1
N$49
  Top 0.3: IC6.6 IC6.5 | IC6.6 IC6.4 | IC6.6 49.55,12.05 R24.1
N$51  (via drill 0.6)
  Top 0.3: R4.1 19.1,6.35 C1.1 21.2,5.45 v21.7,5.45 | Q1.1 29.2,9.85 v28.6,9.25
  Bottom 0.3: v21.7,5.45 22.4,4.75 27.1,4.75 28.6,6.25 v28.6,9.25
N$52  (via drill 0.6)
  Top 0.3: IC3.1 IC3.2 46.4,23.73 46.4,22.05 v47.05,21.4 | R33.1 v50.05,21.4
  Bottom 0.3: v50.05,21.4 v47.05,21.4
N$53
  Top 0.3: Q1.3 31.35,15.9 IC2.9 | Q1.3 30.15,15.95 28.45,17.65 18.45,17.65 R6.1 | R7.2 27.3,13.25 28.75,14.7 Q1.3
N$54  (via drill 0.6)
  Top 0.3: R5.2 22.2,8.45 v21.25,9.4 18.1,9.4 17.15,8.45 IC4.3 | v24.25,15.15 C8.2
  Bottom 0.3: v21.25,9.4 21.25,12.15 v24.25,15.15
N$55  (via drill 0.6)
  Top 0.3: BI.1 14.54,1.33 v14.54,3.29 v14.55,3.3
  Bottom 0.3: C5.1 R38.1 10.35,10.3 14.55,6.1 v14.55,3.3
N$56  (via drill 0.6)
  Top 0.3: v6.4,17.7 6.4,19.39 IC1.3
  Bottom 0.3: C4.2 6.4,15.99 v6.4,17.7
N$57  (via drill 0.6)
  Top 0.3: v5.15,17.7 5.15,19.36 IC1.2
  Bottom 0.3: C3.2 v5.15,17.7
N$58  (via drill 0.6)
  Top 0.3: v7.65,17.7 IC1.4
  Bottom 0.3: C5.2 9.34,15.61 7.65,17.3 v7.65,17.7
N$59  (via drill 0.6)
  Top 0.3: v20.45,18.7 20.67,18.72 IC2.8 30.08,20.37 v30.05,20.85 | v15.25,17.05 15.25,19.39 IC1.10
  Bottom 0.3: v20.45,18.7 16.75,18.7 v15.25,17.05 | v30.05,20.85 30.05,26.45 33.7,30.1 33.7,32.4 34.45,33.15 R9.2
N$60  (via drill 0.6)
  Top 0.3: R5.1 IC4.1 18.38,11.32 v18.35,11.35 | v12.85,11.6 5.7,11.6 R1.1
  Bottom 0.3: v18.35,11.35 17.9,11.35 15.95,9.4 15.05,9.4 v12.85,11.6
N$61  (via drill 0.6)
  Top 0.3: R10.1 R11.2 36,29.8 v34.9,29.8
  Bottom 0.3: R9.1 v34.9,29.8
N$62  (via drill 0.6)
  Top 0.3: C10.1 R8.1 v20.45,16.7 24.5,16.7 R7.1 | v15.95,11.6 15.95,10.43 IC4.5
  Bottom 0.3: v20.45,16.7 18.25,16.7 15.9,14.35 15.9,11.65 v15.95,11.6 | v20.45,16.7 20.6,16.7 | 25.85,19.75 22.8,16.7 v20.45,16.7
N$63
  Top 0.3: IC1.6 10.2,18.15 9.25,17.2 C24.1
N$64
  Top 0.3: R15.2 8.92,27.54 IC1.20
N$65  (via drill 0.6)
  Top 0.3: v4.35,34 CO.1
  Bottom 0.3: R17.1 15.06,31.09 13.8,32.35 6.1,32.35 v4.35,34
N$68  (via drill 0.6)
  Top 0.3: IC1.15 15.27,24.32 v15,24.05
  Bottom 0.3: R17.2 15.25,29.14 15.25,24.3 v15,24.05
PAMU
  Top 0.3: PAMU.1 47.62,4 IC6.3
PSGI
  Top 0.3: PSGI.1 34.92,4.33 C15.1
PSNI
  Top 0.3: PSNI.1 37.47,4.33 C16.1
PWMU
  Top 0.3: PWMU.1 50.16,1.69 48.6,3.25 IC6.2
RESI  (via drill 0.6)
  Top 0.3: RESI.1 45.09,8.91 43.65,10.35 R22.2 R21.2 R20.2 | R20.2 R19.2 33.15,10.35 32.6,10.9 v32.6,13.8 | R20.2 R27.1 | v33.9,16.3 IC2.11
  Bottom 0.3: v32.6,13.8 33.9,15.1 v33.9,16.3
SIN1
  Top 0.3: SIN1.1 40.01,4.34 C17.1
SIN2
  Top 0.3: SIN2.1 42.55,4.34 C18.1
VSO  (via drill 0.6)
  Top 0.3: v15.65,7.25 15.95,7.55 17.1,7.55 18,8.45 IC4.2 20.85,8.45 21.6,7.7 21.6,6.8 22.9,5.5 22.9,4.95 22.23,4.28 VSO.1 | v12.45,10.35 R3.1
  Bottom 0.3: v15.65,7.25 15.55,7.25 v12.45,10.35
(copper drawn outside any net)
  shapes: Top area x2

### Text on the board
tNames: NTSC HIC | BOARD | S-Video | Trim | C13 | + | Version | RBSC | 1.0 | W | + | + | 2021
bNames: Designed for Sony and / Panasonic MSX2 & MSX2+ | NTSC HIC BOARD | Version 1.0 | RBSC 2021